# EAGLE design LEDBoard (EAGLE 5.11)
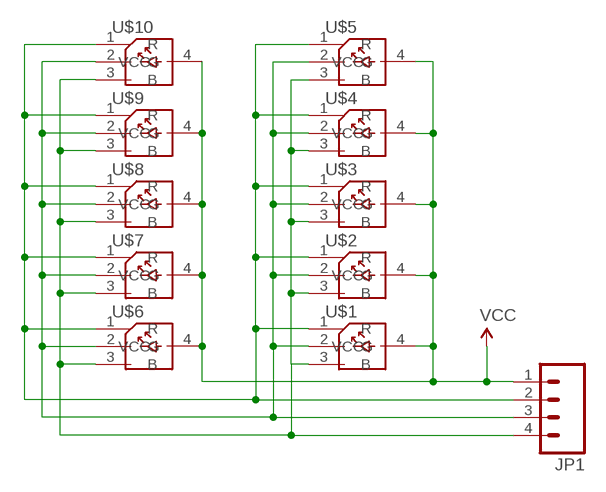
[diagram p0: schematic, sheet 1]

## Parts
JP1  M04POLAR  [MOLEX-1X4]
U$1  BL-FL7680RGBCHALF  [DIP4-PCB01-HALF]
U$2  BL-FL7680RGBCHALF  [DIP4-PCB01-HALF]
U$3  BL-FL7680RGBCHALF  [DIP4-PCB01-HALF]
U$4  BL-FL7680RGBCHALF  [DIP4-PCB01-HALF]
U$5  BL-FL7680RGBCHALF  [DIP4-PCB01-HALF]
U$6  BL-FL7680RGBCHALF  [DIP4-PCB01-HALF]
U$7  BL-FL7680RGBCHALF  [DIP4-PCB01-HALF]
U$8  BL-FL7680RGBCHALF  [DIP4-PCB01-HALF]
U$9  BL-FL7680RGBCHALF  [DIP4-PCB01-HALF]
U$10  BL-FL7680RGBCHALF  [DIP4-PCB01-HALF]

## Nets
N$2: JP1.2 U$1.1(R) U$2.1(R) U$3.1(R) U$4.1(R) U$5.1(R) U$6.1(R) U$7.1(R) U$8.1(R) U$9.1(R) U$10.1(R)
N$3: JP1.3 U$1.2(G) U$2.2(G) U$3.2(G) U$4.2(G) U$5.2(G) U$6.2(G) U$7.2(G) U$8.2(G) U$9.2(G) U$10.2(G)
N$4: JP1.4 U$1.3(B) U$2.3(B) U$3.3(B) U$4.3(B) U$5.3(B) U$6.3(B) U$7.3(B) U$8.3(B) U$9.3(B) U$10.3(B)
VCC: JP1.1 U$1.4(VCC) U$2.4(VCC) U$3.4(VCC) U$4.4(VCC) U$5.4(VCC) U$6.4(VCC) U$7.4(VCC) U$8.4(VCC) U$9.4(VCC) U$10.4(VCC)

## Library data of the parts
JP1 = dek:M04: Header 4 Standard 4-pin 0.1" header. Use with straight break away headers (SKU : PRT-00116), right angle break away headers (PRT-00553), swiss pins (PRT-00743), machine pins (PRT-00117), and female headers (PRT-00115). Molex polarized connector foot print use with SKU : PRT-08231 with associated crimp pins and housings.
U$1-U$10 = dek:BL-FL7680RGBC

## Board
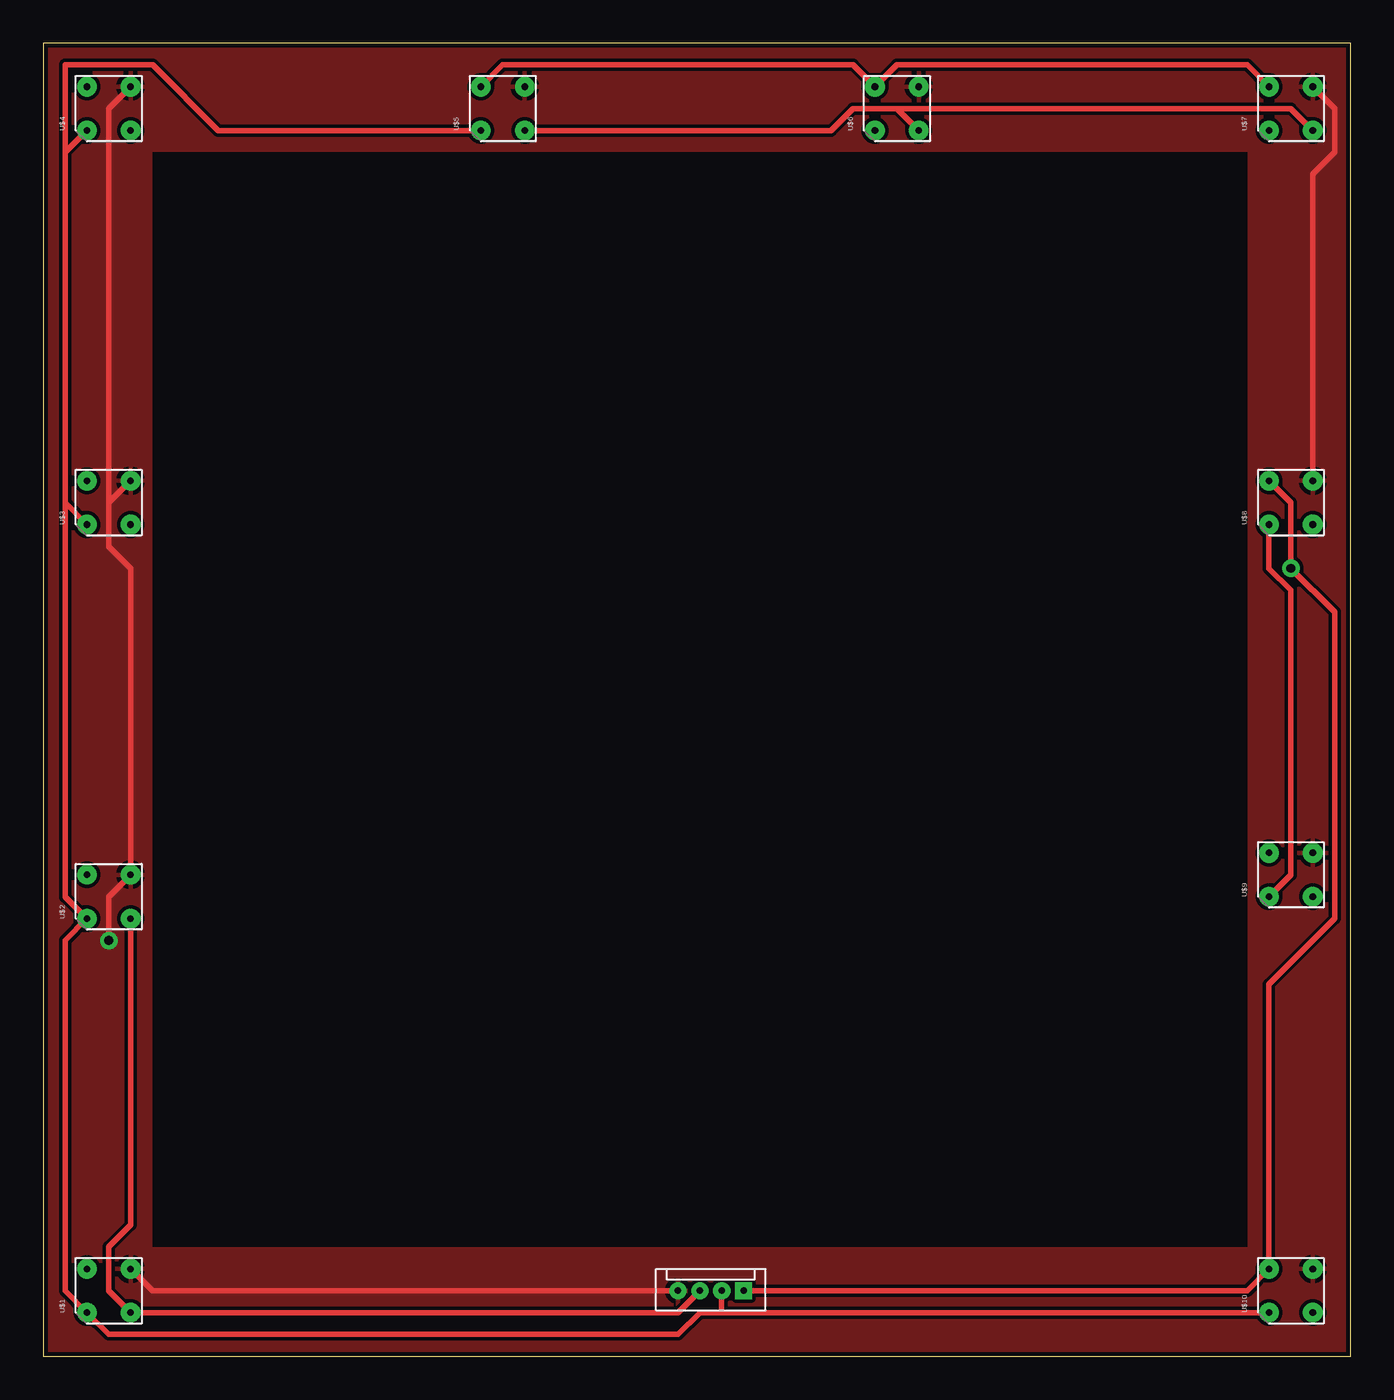
[diagram p1: board, top side]
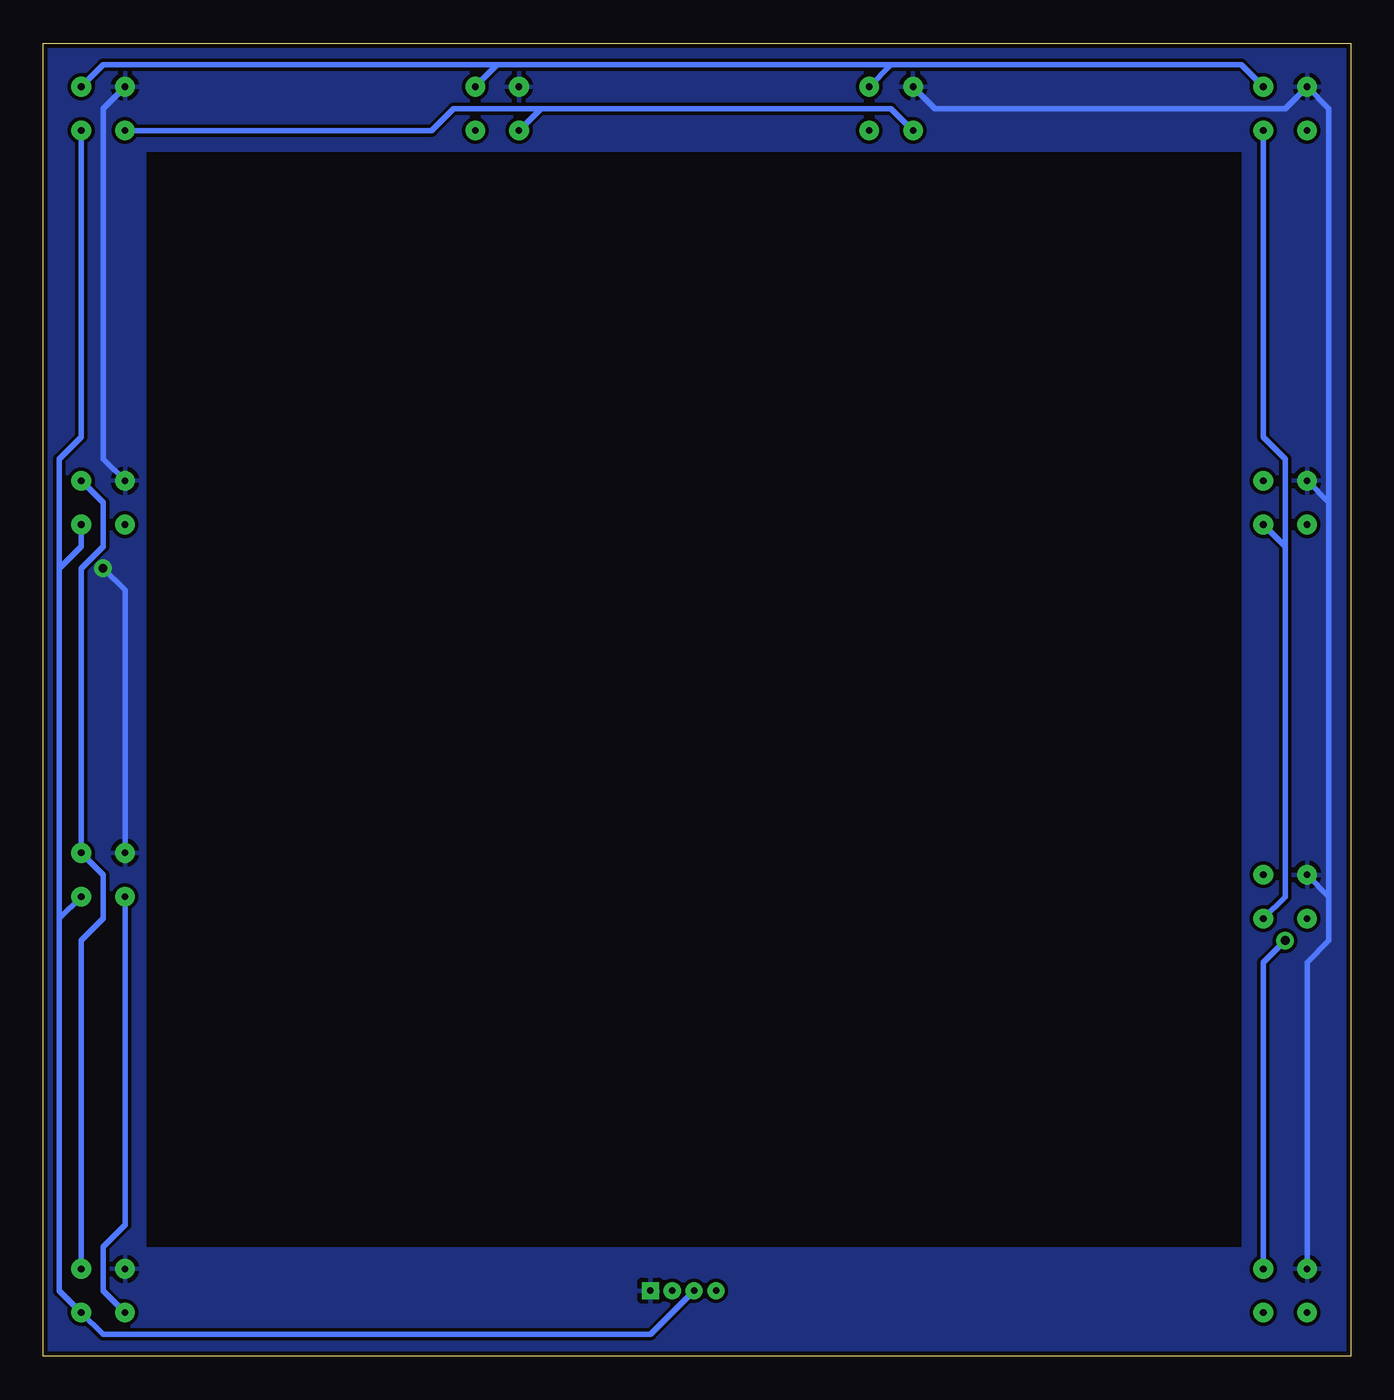
[diagram p2: board, bottom side, seen from below]

Size 75.87 x 76.19 mm. Coordinates in mm from the lower left corner, seen from the top.
Outline: 0,0 75.87,0 75.87,76.19 0,76.19 0,0
Copper layers (1*16): Top 0.035mm / dielectric 1.5mm / Bottom 0.035mm
Design rules "SparkFun": minimum track width 12mil, minimum drill 20mil, track to track 8mil, track to pad 8mil, pad to pad 8mil, via to via 8mil, smd to smd 8mil, copper to edge 10mil, drill to drill 8mil, minimum pad ring 12mil, minimum via ring 10mil, stop-mask expansion 4mil, vias tented up to drill 25mil, thermal gap 10mil
tRestrict: area 6.3,6.3 to 69.8,69.8
bRestrict: area 6.3,6.3 to 69.8,69.8

### Footprints (pad centres in the part's own frame; a part is rotated, then mirrored left to right if it is on the bottom)
MOLEX-1X4 = drill 0.381 pad 0.94 square: 1 0,1.27 | drill 0.381 pad 0.94 round: 2 1.27,1.27; 3 2.54,1.27; 4 3.81,1.27
DIP4-PCB01-HALF = drill 0.381 pad 1.143 round: 1 -1.27,1.27; 2 -1.27,-1.27; 3 1.27,-1.27; 4 1.27,1.27

### Placement (x,y rotation side)
JP1  40.64,5.08 180 top
U$1  3.81,3.81 90 top
U$2  3.81,26.67 90 top
U$3  3.81,49.53 90 top
U$4  3.81,72.39 90 top
U$5  26.67,72.39 90 top
U$6  49.53,72.39 90 top
U$7  72.39,72.39 90 top
U$8  72.39,49.53 90 top
U$9  72.39,27.94 90 top
U$10  72.39,3.81 90 top

### Tracks (layer width: path | path; a pad name or v marks a point on that pad's centre or on a via)
N$2
  Top 0.305: U$9.1 72.39,27.94 72.39,44.45 71.12,45.72 U$8.1 | 39.37,2.54 JP1.2 | 39.37,2.54 U$10.1 | 1.27,49.53 U$3.1 | 1.27,49.53 1.27,69.85 | 1.27,69.85 U$4.1 | 1.27,49.53 1.27,26.67 U$2.1 1.27,24.13 1.27,3.81 U$1.1 3.81,1.27 36.83,1.27 38.1,2.54 39.37,2.54 | U$5.1 10.16,71.12 6.35,74.93 1.27,74.93 1.27,69.85
  Bottom 0.305: U$9.1 71.12,7.62 72.39,6.35 72.39,3.81 U$10.1 | U$5.1 26.67,72.39 46.99,72.39 | 46.99,72.39 U$6.1 | U$7.1 53.34,71.12 52.07,72.39 46.99,72.39
N$3
  Top 0.305: U$5.2 45.72,71.12 46.99,72.39 49.53,72.39 | 49.53,72.39 U$6.2 | U$7.2 72.39,72.39 49.53,72.39 | JP1.3 36.83,2.54 U$1.2 3.81,3.81 3.81,6.35 5.08,7.62 U$2.2
  Bottom 0.305: U$2.2 3.81,26.67 3.81,46.99 | 3.81,46.99 U$3.2 | U$4.2 5.08,53.34 3.81,52.07 3.81,46.99 | 74.93,25.4 74.93,3.81 U$10.2 72.39,1.27 40.64,1.27 JP1.3 | 74.93,25.4 U$9.2 | U$8.2 73.66,46.99 74.93,45.72 | 74.93,25.4 74.93,45.72 | U$7.2 73.66,53.34 74.93,52.07 74.93,45.72
N$4  (via drill 0.51)
  Top 0.305: JP1.4 6.35,3.81 U$1.3 | 3.81,49.53 3.81,46.99 5.08,45.72 U$2.3 3.81,26.67 v3.81,24.13 | 3.81,49.53 U$3.3 | U$4.3 3.81,72.39 3.81,49.53 | U$8.3 73.66,68.58 74.93,69.85 74.93,72.39 U$7.3
  Bottom 0.305: U$10.3 73.66,24.13 72.39,25.4 72.39,27.94 U$9.3 73.66,45.72 72.39,46.99 72.39,49.53 U$8.3 | 26.67,74.93 U$5.3 | 26.67,74.93 6.35,74.93 U$4.3 | 49.53,74.93 U$6.3 | 26.67,74.93 49.53,74.93 | U$7.3 72.39,74.93 49.53,74.93 | U$1.3 5.08,22.86 v3.81,24.13
  pour Top: -1.27,77.47 77.47,77.47 77.47,-1.27 -1.27,-1.27
VCC  (via drill 0.51)
  Top 0.305: JP1.1 69.85,3.81 U$10.4 71.12,21.59 74.93,25.4 74.93,43.18 v72.39,45.72 72.39,49.53 U$8.4 | U$5.4 26.67,74.93 46.99,74.93 U$6.4 49.53,74.93 69.85,74.93 U$7.4
  Bottom 0.305: U$1.4 2.54,22.86 1.27,24.13 1.27,26.67 | 1.27,26.67 U$2.4 | 1.27,49.53 U$3.4 | 1.27,26.67 1.27,49.53 | 1.27,49.53 1.27,72.39 U$4.4 3.81,72.39 24.13,72.39 U$5.4 | U$9.4 71.12,44.45 v72.39,45.72 | U$7.4 72.39,72.39 72.39,52.07 U$8.4
  pour Bottom: -1.27,77.47 77.47,77.47 77.47,-1.27 -1.27,-1.27